# EAGLE design Lab_6 (EAGLE 9.6.2)
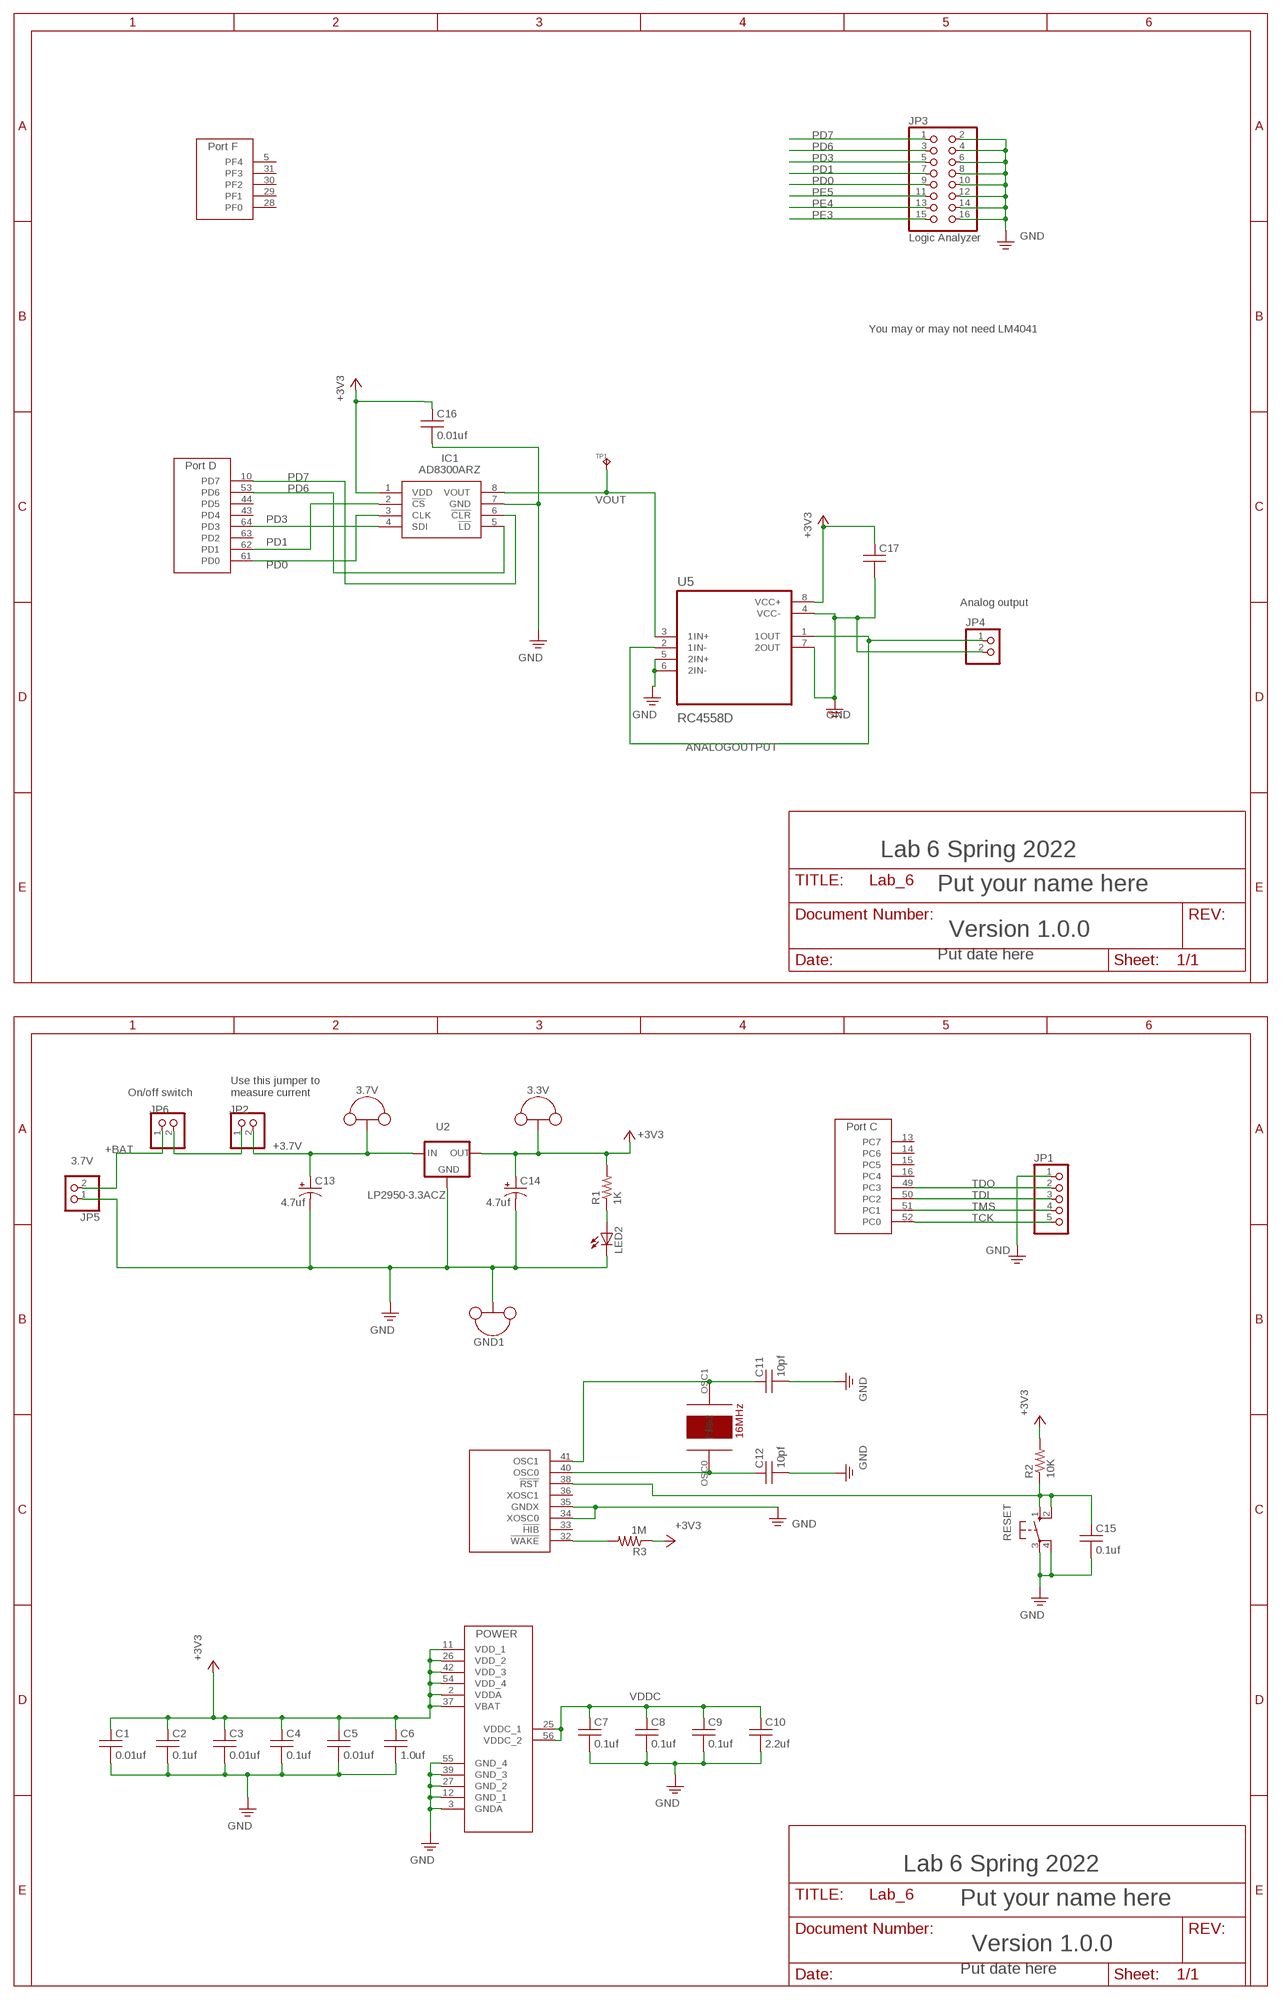
[diagram p0: schematic, sheet 1, part 1 of 2]
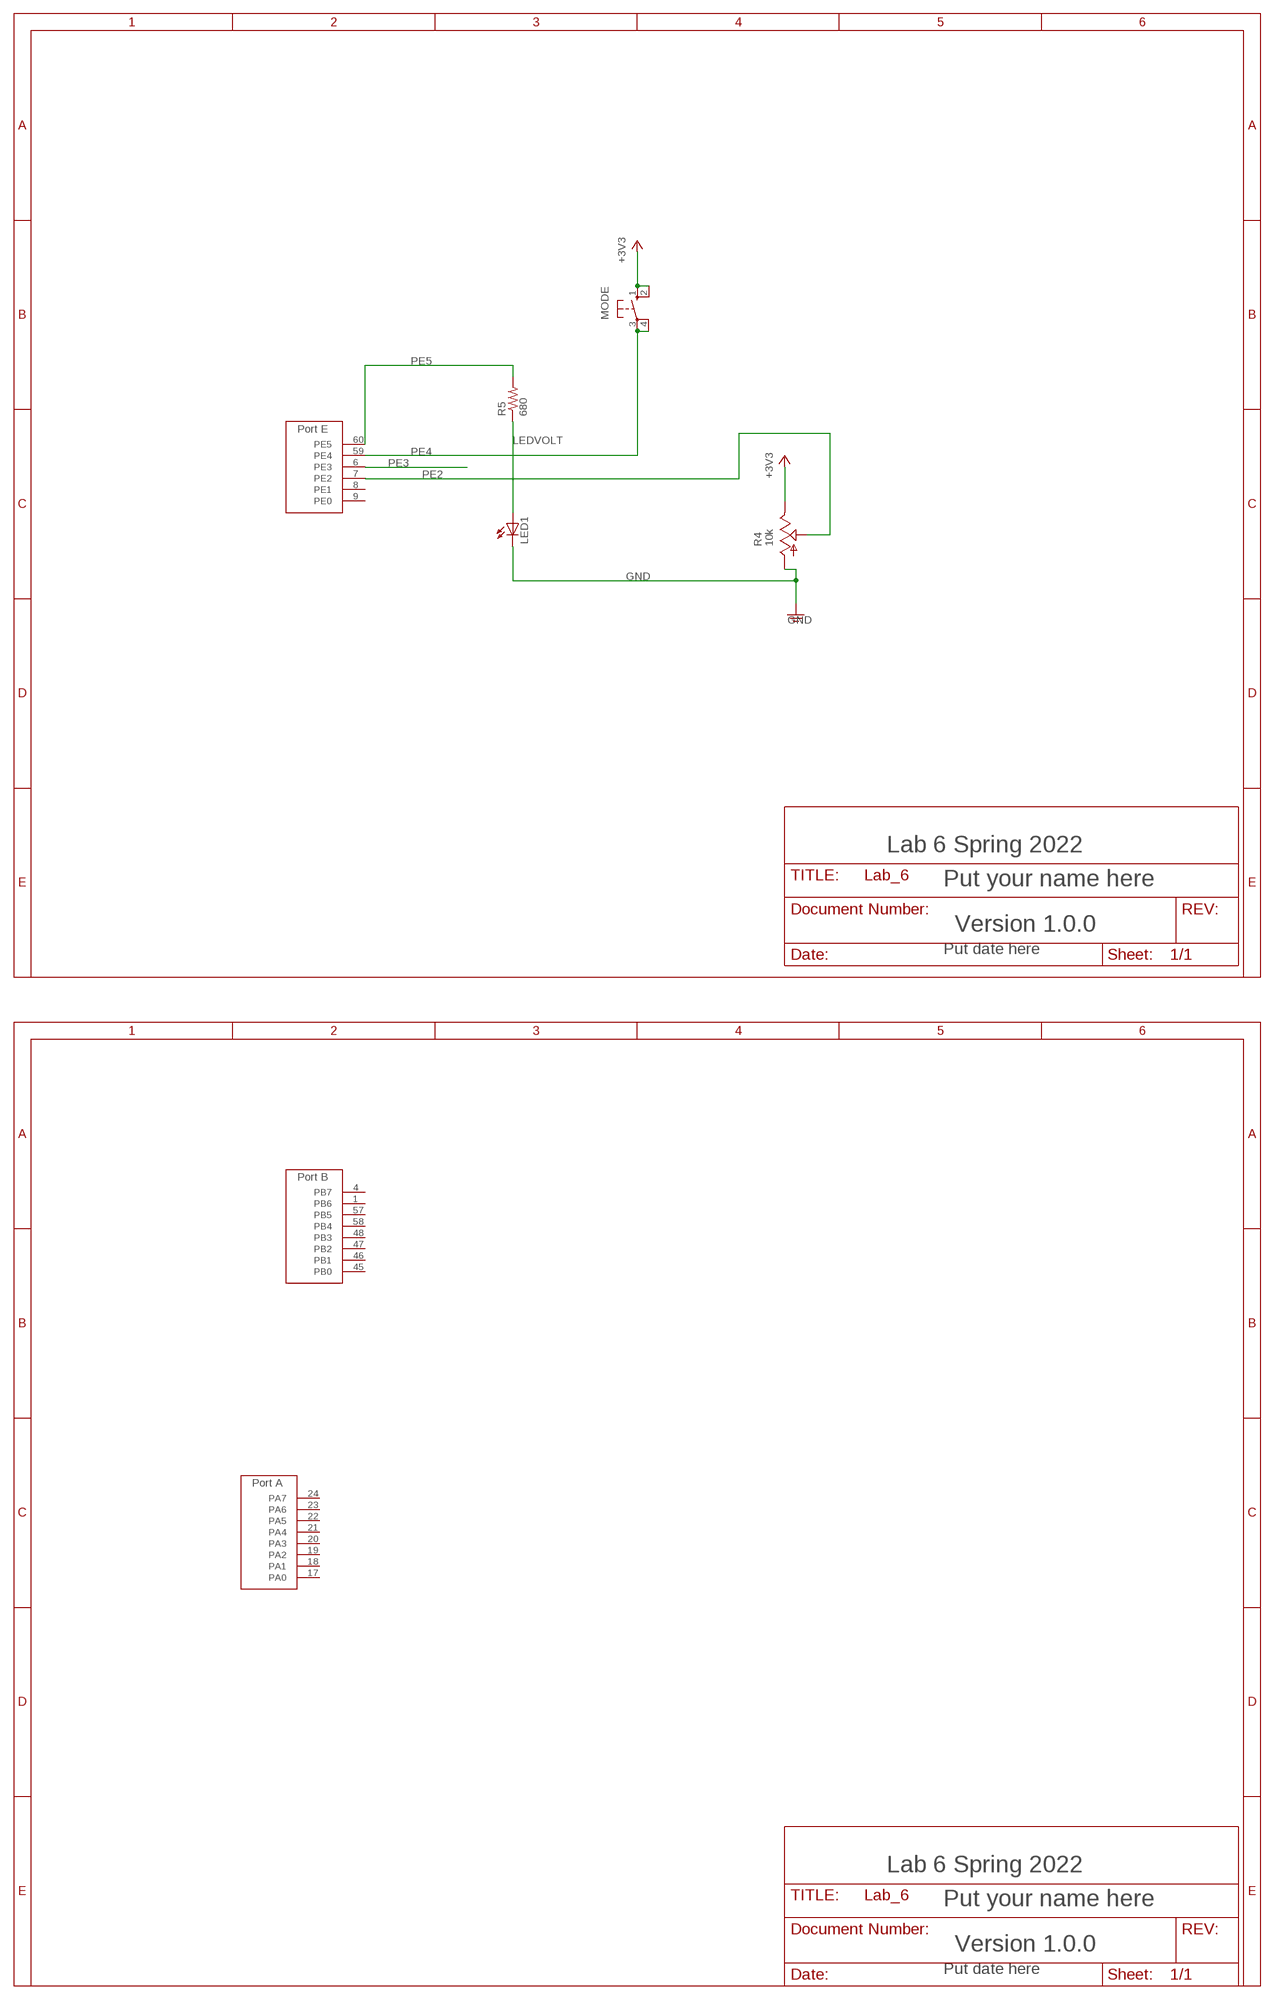
[diagram p1: schematic, sheet 1, part 2 of 2]

## Parts
3.3V  TP_LOOP  [TP_LOOP]
3.7V  TP_LOOP  [TP_LOOP]
C1  0.01uf  CAPACITOR025-024X044  [CAP100MIL]
C2  0.1uf  CAPACITOR025-024X044  [CAP100MIL]
C3  0.01uf  CAPACITOR025-024X044  [CAP100MIL]
C4  0.1uf  CAPACITOR025-024X044  [CAP100MIL]
C5  0.01uf  CAPACITOR025-024X044  [CAP100MIL]
C6  1.0uf  CAPACITOR025-024X044  [CAP100MIL]
C7  0.1uf  CAPACITOR025-024X044  [CAP100MIL]
C8  0.1uf  CAPACITOR025-024X044  [CAP100MIL]
C9  0.1uf  CAPACITOR025-024X044  [CAP100MIL]
C10  2.2uf  CAPACITOR025-024X044  [CAP100MIL]
C11  10pf  CAPACITOR025-024X044  [CAP100MIL]
C12  10pf  CAPACITOR025-024X044  [CAP100MIL]
C13  4.7uf  CAPACITOR_POLARIZEDE5-6  [CAP200MILPOLARIZED]
C14  4.7uf  CAPACITOR_POLARIZEDE5-6  [CAP200MILPOLARIZED]
C15  0.1uf  CAPACITOR025-024X044  [CAP100MIL]
C16  0.01uf  CAPACITOR025-024X044  [CAP100MIL]
C17  0.01uf  CAPACITOR025-024X044  [CAP100MIL]
GND1  TP_LOOP  [TP_LOOP]
IC1  AD8300ARZ  [SOIC127P600X175-8N]
JP1  PINHD-1X5  [1X05]
JP2  PINHD-1X2  [1X02]
JP3  Logic Analyzer  PINHD-2X8  [2X08]
JP4  PINHD-1X2  [1X02]
JP5  PINHD-1X2  [1X02]
JP6  PINHD-1X2  [1X02]
LED1  LED3MM  [LED3MM]
LED2  LED3MM  [LED3MM]
MODE  B3F-1052  [B3F-10XX]
R1  1K  RESISTOR0204/5  [RES200MIL]
R2  10K  RESISTOR0204/5  [RES200MIL]
R3  1M  RESISTOR0204/5  [RES200MIL]
R4  10k  POTENTIOMETER_PTA2043B25U  [PTA2043]
R5  680  RESISTOR0204/5  [RES200MIL]
RESET  B3F-1052  [B3F-10XX]
TP1  TP_KEYSTONE500X  [P1.1MM]
U1  TM4C123GH6PM  [QFP50P1200X1200X160-64N]
U2  LP2950-3.3ACZ  [TO92]
U5  RC4558D  [SOIC127P599X175-8N]
Y1  16MHZ_CRYSTAL  [16MHZ_CRYSTAL]

## Nets
+3.7V: 3.7V.P$1(TP) 3.7V.P$2(TP) C13.+ JP2.2 U2.3(IN)
+3V3: 3.3V.P$1(TP) 3.3V.P$2(TP) C1.1 C2.1 C3.1 C4.1 C5.1 C6.1 C14.+ C16.1 C17.1 IC1.1(VDD) MODE.1(S) MODE.2(S1) R1.2 R2.2 R3.1 R4.1(E) U1.2(VDDA) U1.11(VDD_1) U1.26(VDD_2) U1.37(VBAT) U1.42(VDD_3) U1.54(VDD_4) U2.1(OUT) U5.8(VCC+)
+BAT: JP5.2 JP6.1
ANALOGOUTPUT: JP4.1 U5.1(1OUT) U5.2(1IN-)
GND: C1.2 C2.2 C3.2 C4.2 C5.2 C6.2 C7.2 C8.2 C9.2 C10.2 C11.2 C12.2 C13.- C14.- C15.2 C16.2 C17.2 GND1.P$1(TP) GND1.P$2(TP) IC1.7(GND) JP1.1 JP3.2 JP3.4 JP3.6 JP3.8 JP3.10 JP3.12 JP3.14 JP3.16 JP4.2 JP5.1 LED1.K(C) LED2.K(C) R4.3(A) RESET.3(P) RESET.4(P1) U1.3(GNDA) U1.12(GND_1) U1.27(GND_2) U1.34(XOSC0) U1.35(GNDX) U1.39(GND_3) U1.55(GND_4) U2.2(GND) U5.4(VCC-) U5.5(2IN+) U5.6(2IN-) U5.7(2OUT)
LEDVOLT: LED1.A R5.1
OSC0: C12.1 U1.40(OSC0) Y1.OSC0
OSC1: C11.1 U1.41(OSC1) Y1.OSC1
PD0: IC1.3(CLK) JP3.9 U1.61(PD0)
PD1: IC1.2(!CS) JP3.7 U1.62(PD1)
PD3: IC1.4(SDI) JP3.5 U1.64(PD3)
PD6: IC1.5(!LD) JP3.3 U1.53(PD6)
PD7: IC1.6(!CLR) JP3.1 U1.10(PD7)
PE2: R4.2(S) U1.7(PE2)
PE3: JP3.15 U1.6(PE3)
PE4: JP3.13 MODE.3(P) MODE.4(P1) U1.59(PE4)
PE5: JP3.11 R5.2 U1.60(PE5)
POWERLED: LED2.A R1.1
RESET: C15.1 R2.1 RESET.1(S) RESET.2(S1) U1.38(!RST)
SWITCHEDPOWER: JP2.1 JP6.2
TCK: JP1.5 U1.52(PC0)
TDI: JP1.3 U1.50(PC2)
TDO: JP1.2 U1.49(PC3)
TMS: JP1.4 U1.51(PC1)
VDDC: C7.1 C8.1 C9.1 C10.1 U1.25(VDDC_1) U1.56(VDDC_2)
VOUT: IC1.8(VOUT) TP1.TP U5.3(1IN+)
WAKE: R3.2 U1.32(!WAKE)
Unconnected: U1.1(PB6) U1.4(PB7) U1.5(PF4) U1.8(PE1) U1.9(PE0) U1.13(PC7) U1.14(PC6) U1.15(PC5) U1.16(PC4) U1.17(PA0) U1.18(PA1) U1.19(PA2) U1.20(PA3) U1.21(PA4) U1.22(PA5) U1.23(PA6) U1.24(PA7) U1.28(PF0) U1.29(PF1) U1.30(PF2) U1.31(PF3) U1.33(!HIB) U1.36(XOSC1) U1.43(PD4) U1.44(PD5) U1.45(PB0) U1.46(PB1) U1.47(PB2) U1.48(PB3) U1.57(PB5) U1.58(PB4) U1.63(PD2)

## Notes on the sheet
- You may or may not need LM4041
- Analog output
- Lab 6 Spring 2022
- Lab 6 Spring 2022
- Put your name here
- Put your name here
- Version 1.0.0
- Version 1.0.0
- Put date here
- Put date here
- On/off switch
- Use this jumper to
  measure current
- 3.7V
- Lab 6 Spring 2022 | Lab 6 Spring 2022
- Put your name here | Put your name here
- Version 1.0.0 | Version 1.0.0
- Put date here | Put date here

## Library data of the parts
3.3V 3.7V GND1 = EE445L:TP_LOOP
C1-C12 C15-C17 = EE445L:CAPACITOR: CAPACITOR, American symbol
C13 C14 = EE445L:CAPACITOR_POLARIZED: POLARIZED CAPACITOR, American symbol
IC1 = AD8300ARZ:AD8300ARZ: DAC 1-Ch R-2R 12-Bit 8-Pin SOIC Source: Datasheet <https://datasheet.datasheetarchive.com/originals/distributors/Datasheets-4/DSA-70310.pdf>; DESCRIPTION: DAC 1-Ch R-2R 12-Bit 8-Pin SOIC; HEIGHT: 1.75mm; MANUFACTURER_NAME: Analog Devices; MANUFACTURER_PART_NUMBER: AD8300ARZ
JP1 = EE445L:PINHD-1X5: PIN HEADER
JP2 JP4-JP6 = EE445L:PINHD-1X2: PIN HEADER
JP3 = EE445L:PINHD-2X8: PIN HEADER
LED1 LED2 = EE445L:LED: Avago Technologies LED Green 2mA 5mm diffused, HLMP-4740, Digikey 516-1327-ND Red 1.6V 1mA 5mm diffused, HLMP-D150, Digikey 516-1323-ND Yellow 2mA 5mm diffused, HLMP-4719, Digikey 516-1326-ND Orange 10mA 5mm diffused HLMP-D401, Digikey 516-1330-ND Blue 10mA 5mm diffused
MODE RESET = EE445L:B3F-1052: OMRON SWITCH 1.1mm holes; MPN: B3F-1000; OC_FARNELL: 176432; OC_NEWARK: 36M3542
R1-R3 R5 = EE445L:RESISTOR: RESISTOR, American symbol
R4 = EE445L:POTENTIOMETER_PTA2043: POTENTIOMETER Warning There are many many sizes and shapes of potentiometers. Please verify both the wiring and the physical layout of your pots.
TP1 = EE445L:TP: Test pad Test point, black, Keystone Electronics 5001, Digikey 5001K-ND Test point, orange, Keystone Electronics 5003, Digikey 5003K-ND Test point, yellow, Keystone Electronics 5004, Digikey 5004K-ND Test point, white, Keystone Electronics 5002, Digikey 5002K-ND Test point, red, Keystone Electronics 5000, Digikey 5000K-ND
U1 = EE445L:TM4C123GH6PM
U2 = EE445L:LP2950: LP2950 3.3V regulator, 100 mA TO-92 On Semiconductor LP2950ACZ-3.3G, Mouser 863-LP2950ACZ-3.3G
U5 = RC4558D:RC4558D: Check availability <https://pricing.snapeda.com/parts/RC4558D/Texas%20Instruments/view-part?ref=eda>; AVAILABILITY: In Stock; DESCRIPTION: Dual, 30-V, 3-MHz, low noise (8-nV/√Hz) operational amplifier; MF: Texas Instruments; MP: RC4558D; PACKAGE: SOIC-8 Texas Instruments; PRICE: None; PURCHASE-URL: https://pricing.snapeda.com/search/part/RC4558D/?ref=eda
Y1 = EE445L:16MHZ_CRYSTAL

## Board
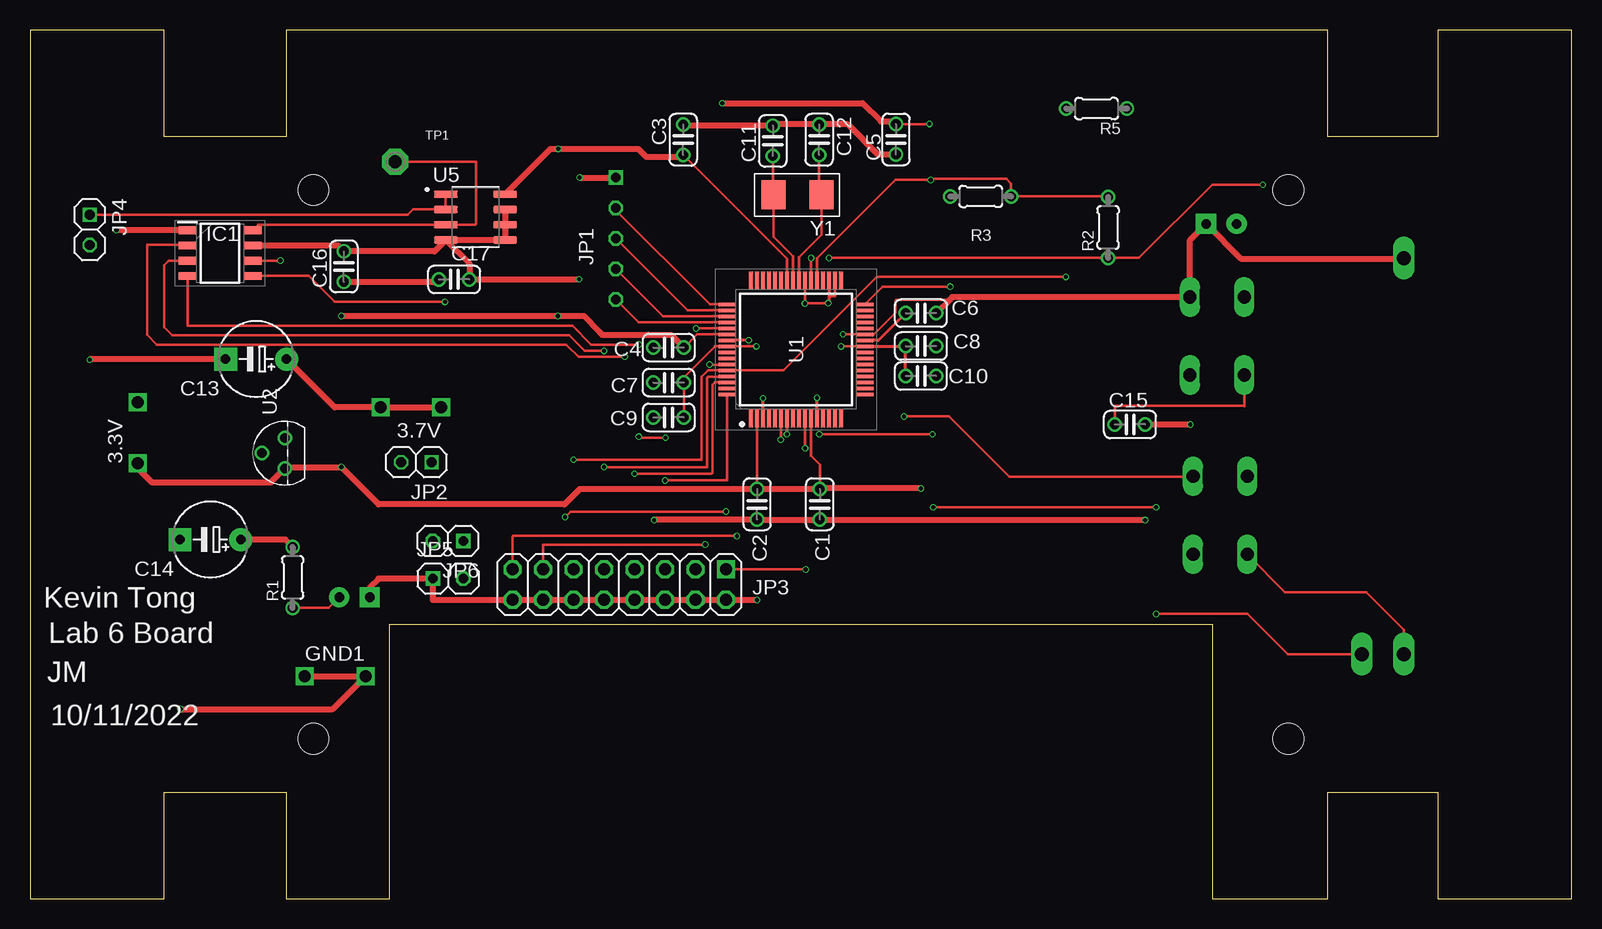
[diagram p2: board, top side]
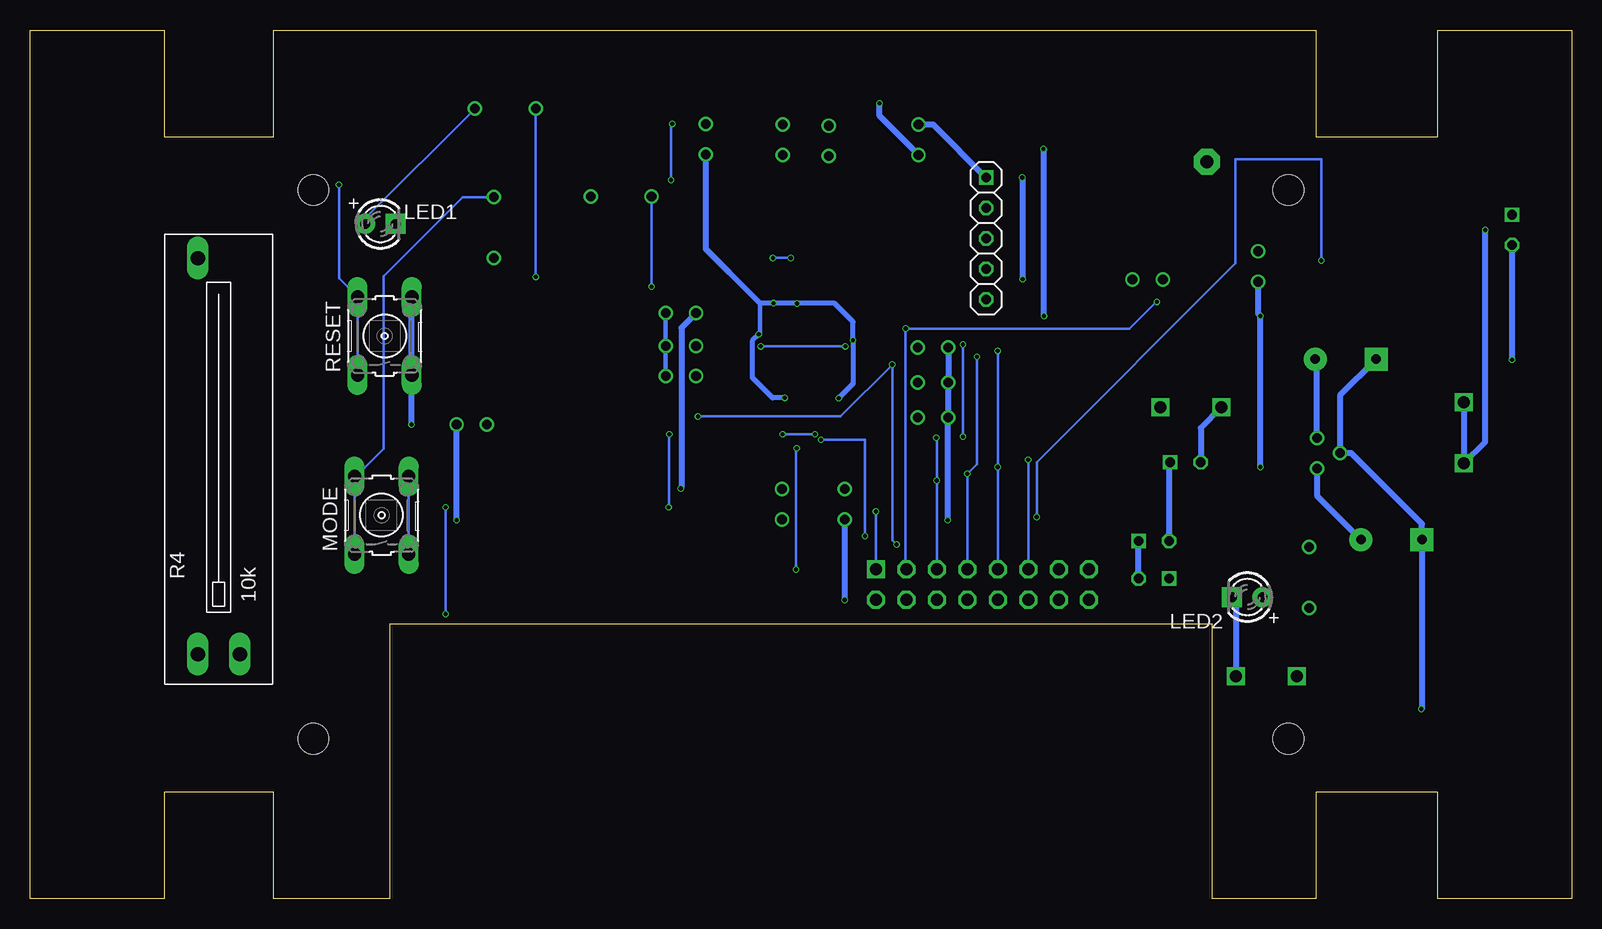
[diagram p3: board, bottom side, seen from below]

Size 128.52 x 72.39 mm. Coordinates in mm from the lower left corner, seen from the top.
Outline: 0,0 11.18,0 11.18,8.89 21.34,8.89 21.34,0 29.97,0 29.97,22.86 98.55,22.86 98.55,0 108.2,0 108.2,8.89 117.35,8.89 117.35,0 128.52,0 128.52,72.39 117.35,72.39 117.35,63.5 108.2,63.5 108.2,72.39 21.34,72.39 21.34,63.5 11.18,63.5 11.18,72.39 0,72.39 0,0
Copper layers (1*16): Top 0.035559375mm / dielectric 1.6mm / Bottom 0.035559375mm
Design rules "jlcpcb2layer": minimum track width 5mil, minimum drill 12mil, track to track 5mil, track to pad 5mil, pad to pad 5mil, via to via 5mil, smd to smd 5mil, copper to edge 8mil, drill to drill 6mil, minimum pad ring 5mil, minimum via ring 3mil, stop-mask expansion 2.5mil, vias tented up to drill 0mil, thermal gap 10mil
Holes 2.54 mm at 23.62,13.34 104.9,13.34 104.9,59.05 23.62,59.05

### Footprints (pad centres in the part's own frame; a part is rotated, then mirrored left to right if it is on the bottom)
TP_LOOP = drill 1 square: P$1 0,0; P$2 5.08,0
CAP100MIL = drill 0.8: 1 -1.27,0; 2 1.27,0
CAP200MILPOLARIZED = drill 0.8 pad 1.905: + -2.54,0 | drill 0.8 pad 1.905 square: - 2.54,0
SOIC127P600X175-8N = smd 1.525 x 0.65: 1 -2.712,1.905; 2 -2.712,0.635; 3 -2.712,-0.635; 4 -2.712,-1.905; 5 2.712,-1.905; 6 2.712,-0.635; 7 2.712,0.635; 8 2.712,1.905
1X05 = drill 0.8 square: 1 -5.08,0 | drill 0.8 octagon: 2 -2.54,0; 3 0,0; 4 2.54,0; 5 5.08,0
1X02 = drill 0.8 square: 1 -1.27,0 | drill 0.8 octagon: 2 1.27,0
2X08 = drill 1 square: 1 -8.89,-1.27 | drill 1 octagon: 2 -8.89,1.27; 3 -6.35,-1.27; 4 -6.35,1.27; 5 -3.81,-1.27; 6 -3.81,1.27; 7 -1.27,-1.27; 8 -1.27,1.27; 9 1.27,-1.27; 10 1.27,1.27; 11 3.81,-1.27; 12 3.81,1.27; 13 6.35,-1.27; 14 6.35,1.27; 15 8.89,-1.27; 16 8.89,1.27
LED3MM = drill 0.8 pad 1.676: A -1.27,0 | drill 0.8 pad 1.676 square: K 1.27,0
B3F-10XX = drill 1.1 long: 1 -3.251,2.261; 2 3.251,2.261; 3 -3.251,-2.261; 4 3.251,-2.261
RES200MIL = drill 0.8: 1 -2.54,0; 2 2.54,0
PTA2043 = drill 1.194 long: 1 -13,1.75; 2 -13,-1.75; 3 20,1.75
P1.1MM = drill 1.1 pad 2.159 octagon: TP 0,0
QFP50P1200X1200X160-64N = smd 1.475 x 0.3: 1 -5.738,3.75; 2 -5.738,3.25; 3 -5.738,2.75; 4 -5.738,2.25; 5 -5.738,1.75; 6 -5.738,1.25; 7 -5.738,0.75; 8 -5.738,0.25; 9 -5.738,-0.25; 10 -5.738,-0.75; 11 -5.738,-1.25; 12 -5.738,-1.75; 13 -5.738,-2.25; 14 -5.738,-2.75; 15 -5.738,-3.25; 16 -5.738,-3.75; 33 5.738,-3.75; 34 5.738,-3.25; 35 5.738,-2.75; 36 5.738,-2.25; 37 5.738,-1.75; 38 5.738,-1.25; 39 5.738,-0.75; 40 5.738,-0.25; 41 5.738,0.25; 42 5.738,0.75; 43 5.738,1.25; 44 5.738,1.75; 45 5.738,2.25; 46 5.738,2.75; 47 5.738,3.25; 48 5.738,3.75 | smd 0.3 x 1.475: 17 -3.75,-5.738; 18 -3.25,-5.738; 19 -2.75,-5.738; 20 -2.25,-5.738; 21 -1.75,-5.738; 22 -1.25,-5.738; 23 -0.75,-5.738; 24 -0.25,-5.738; 25 0.25,-5.738; 26 0.75,-5.738; 27 1.25,-5.738; 28 1.75,-5.738; 29 2.25,-5.738; 30 2.75,-5.738; 31 3.25,-5.738; 32 3.75,-5.738; 49 3.75,5.738; 50 3.25,5.738; 51 2.75,5.738; 52 2.25,5.738; 53 1.75,5.738; 54 1.25,5.738; 55 0.75,5.738; 56 0.25,5.738; 57 -0.25,5.738; 58 -0.75,5.738; 59 -1.25,5.738; 60 -1.75,5.738; 61 -2.25,5.738; 62 -2.75,5.738; 63 -3.25,5.738; 64 -3.75,5.738
TO92 = drill 0.8: 1 -1.27,0; 2 0,1.905; 3 1.27,0
SOIC127P599X175-8N = smd 1.97 x 0.6: 1 -2.47,1.905; 2 -2.47,0.635; 3 -2.47,-0.635; 4 -2.47,-1.905; 5 2.47,-1.905; 6 2.47,-0.635; 7 2.47,0.635; 8 2.47,1.905
16MHZ_CRYSTAL = smd 2 x 2.4: OSC0 1,1.27; OSC1 5,1.27

### Placement (x,y rotation side)
3.3V  8.99,36.27 90 top
3.7V  34.29,40.94 180 top
C1  65.84,32.87 270 top
C2  60.6,32.87 270 top
C3  54.46,63.25 90 top
C4  53.24,45.92 180 top
C5  72.19,63.27 270 top
C6  74.27,48.79 0 top
C7  53.24,43 180 top
C8  74.27,46.05 0 top
C9  53.24,40.11 180 top
C10  74.27,43.56 0 top
C11  61.93,63.14 90 top
C12  65.79,63.25 90 top
C13  18.85,44.96 180 top
C14  15.04,29.92 180 top
C15  91.69,39.52 0 top
C16  26.16,52.68 90 top
C17  35.36,51.61 0 top
GND1  22.91,18.54 0 top
IC1  15.85,53.8 0 top
JP1  48.82,55.02 270 bottom
JP2  32.21,36.37 180 top
JP3  49.12,26.16 180 top
JP4  4.98,55.73 270 top
JP5  34.85,26.67 0 top
JP6  34.85,29.82 180 top
LED1  99.31,56.24 0 bottom
LED2  27.05,25.12 180 bottom
MODE  99.21,31.95 90 bottom
R1  21.89,26.77 90 top
R2  89.87,55.93 90 top
R3  79.25,58.52 180 top
R4  112.78,33.38 90 bottom
R5  88.9,65.84 180 top
RESET  98.96,46.89 90 bottom
TP1  30.43,61.42 0 top
U1  63.86,45.77 90 top
U2  21.23,37.13 90 top
U5  37.13,56.79 0 top
Y1  66.98,59.92 180 top

### Tracks (layer width: path | path; a pad name or v marks a point on that pad's centre or on a via)
+3.7V
  Top 0.508: 3.7V.P$1 3.7V.P$2 25.4,40.95 C13.+
  Bottom 0.508: 3.7V.P$2 30.94,39.22 JP2.2 | U2.3 21.23,44.81 C13.+
+3V3  (via drill 0.35)
  Top 0.203: U1.2 C2.1 | U1.11 65.11,36.9 65.84,36.17 65.84,34.34 C1.1 | C3.1 54.53,61.9 63.11,53.33 U1.42 | U1.37 65.61,53.36 72.14,59.89 v75.08,59.89 75.18,59.99 81.38,59.99 81.79,59.59 R3.1 89.81,58.52 R2.2 | v74.98,64.57 74.95,64.54 C5.1 | MODE.1 104.62,25.55 111.4,25.55 114.53,22.43 R4.1 | U1.54 55.61,47.02 C4.1
  Top 0.254: C6.1 70.73,46.52 U1.26
  Top 0.508: 3.3V.P$1 8.99,35.87 10.16,34.7 20.07,34.7 U2.1 21.34,35.97 v25.96,35.97 29.06,32.87 44.55,32.87 45.82,34.14 C2.1 | R1.2 21.29,29.92 C14.+ | v25.96,48.56 v43.99,48.56 46.18,48.56 47.5,47.24 47.5,47.19 47.7,46.99 53.44,46.99 C4.1 | C1.1 C2.1 | v74.27,34.19 65.99,34.19 65.84,34.34 | 54.53,61.9 54.46,61.82 51.36,61.82 50.7,62.48 v44.04,62.48 43.39,62.48 U5.8 | v57.71,66.29 69.39,66.29 70.92,64.77 72.05,64.77 C5.1 | C16.1 33.88,51.41 C17.1 | v7.21,55.73 13.11,55.73 IC1.1
  Bottom 0.203: v75.08,59.89 75.08,64.47 v74.98,64.57 | R2.2 92.46,58.47 99.06,51.87 99.06,37.49 101.35,35.2 MODE.2 MODE.1
  Bottom 0.508: 3.3V.P$2 3.3V.P$1 7.21,38.05 v7.21,55.73 | U2.1 21.23,33.58 C14.+ | v25.96,35.97 v25.96,48.56 26.16,48.77 C16.1 | C6.1 74.22,47.57 74.22,34.24 v74.27,34.19 | v43.99,48.56 43.99,62.43 v44.04,62.48 | C3.1 57.71,65.23 v57.71,66.29
+BAT
  Bottom 0.508: JP5.2 JP6.1
ANALOGOUTPUT
  Top 0.203: JP4.1 31.5,57 31.95,57.45 34.64,57.45 U5.2 U5.1
GND  (via drill 0.35)
  Top 0.203: v67.77,47.04 67.79,47.02 U1.27 70.34,47.02 72.14,48.82 72.14,49.84 72.22,49.92 76.67,49.92 | v59.91,46.54 59.89,46.52 | v65.61,41.73 | U1.34 67.11,50.19 66.61,50.19 | v66.55,49.63 64.62,49.63 v64.59,49.61 64.61,49.62 U1.39
  Top 0.254: U1.3 v61.11,41.71 | 59.89,46.52 U1.55 | U1.12 v65.61,41.73 | U1.35 66.61,50.19 66.61,49.69 v66.55,49.63
  Top 0.508: v60.6,24.89 JP3.2 JP3.4 JP3.6 JP3.8 JP3.10 JP3.12 JP3.14 JP3.16 33.58,24.89 JP5.1 29.06,26.67 28.32,25.93 LED2.K | GND1.P$1 GND1.P$2 25.25,15.8 v12.55,15.8 | v52.02,31.55 52.07,31.6 C2.2 C1.2 92.91,31.6 v92.96,31.55 | C15.2 v96.72,39.52 | C6.2 76.67,49.92 76.89,50.14 RESET.4 96.7,54.89 LED1.K 100.94,53.34 114.49,53.34 R4.3 | C5.2 70.69,62 68.17,64.52 C12.2 62.03,64.52 C11.2 54.56,64.41 C3.2 | v45.77,51.61 C17.2 36.63,52.93 U5.4 | v45.82,60.1 JP1.1 | U5.4 33.73,53.95 C16.2 25.68,54.43 IC1.7 | C13.- 5.03,44.96 v4.98,44.91 | U5.7 U5.6 U5.5 U5.4
  Bottom 0.203: v61.11,41.71 61.11,41.73
  Bottom 0.381: C10.2 75.54,46.4 75.46,46.48 C8.2 C6.2 | v67.77,47.04 67.67,47.14 67.67,49.61
  Bottom 0.406: 61.11,41.73 59.91,42.93 v59.91,46.54 59.91,48.08 61.44,49.61 v64.59,49.61 67.67,49.61 70.23,52.17 | v67.77,47.04 68.33,46.48 68.33,43.43 66.62,41.73 v65.61,41.73
  Bottom 0.508: v60.6,24.89 C2.2 | LED2.K 27.99,24.79 GND1.P$2 | v52.02,31.55 52.02,40.06 C9.2 C7.2 C4.2 | v92.96,31.55 C15.2 | v96.72,39.52 96.72,43.61 RESET.3 RESET.4 | 70.23,52.17 72.19,54.13 C5.2 | C3.2 53.24,64.52 JP1.1 | v45.77,51.61 45.77,60.05 v45.82,60.1 | v4.98,44.91 JP4.2 | C13.- 19.33,41.94 U2.2 18.39,37.13 12.5,31.24 C14.- 12.5,15.85 v12.55,15.8
LEDVOLT
  Bottom 0.203: R5.1 100.58,56.69 LED1.A
OSC0
  Top 0.203: U1.40 64.11,53.44 65.99,55.32 Y1.OSC0 65.79,58.84 C12.1
OSC1
  Top 0.203: U1.41 63.61,53.54 61.98,55.17 Y1.OSC1 61.92,58.7 C11.1
PD0  (via drill 0.35)
  Top 0.203: U1.61 58.08,43.48 56.54,43.48 56.44,43.38 56.44,35.97 v47.85,35.97 | IC1.3 11.56,53.16 11.18,52.78 11.18,47.6 11.84,46.94 44.96,46.94 46.24,45.65 v47.85,45.65
  Bottom 0.203: JP3.9 v47.85,35.97 v47.85,45.65
PD1  (via drill 0.35)
  Top 0.203: U1.62 57.11,43.02 57.1,43.03 56.9,42.82 56.9,35.51 56.79,35.41 v50.39,35.41 | v49.58,45.16 45.72,45.16 44.7,46.18 10.57,46.18 9.75,46.99 9.75,54.51 13.06,54.51 IC1.2
  Bottom 0.203: JP3.7 v50.39,35.41 49.58,36.22 v49.58,45.16
PD3  (via drill 0.35)
  Top 0.203: U1.64 58.12,34.85 v52.93,34.85 | v52.98,38.41 50.85,38.41 v50.75,38.51 | v50.75,46.18 46.79,46.18 45.21,47.75 13.16,47.75 13.14,47.77 IC1.4
  Bottom 0.203: JP3.5 v52.93,34.85 52.93,38.35 v52.98,38.41 | v50.75,38.51 v50.75,46.18
PD6  (via drill 0.35)
  Top 0.203: U1.53 55.53,47.52 v55.52,47.51 | v34.59,49.73 25.4,49.73 23.22,51.92 18.59,51.92 IC1.5
  Bottom 0.203: JP3.3 55.52,27.48 v55.52,47.51 36.87,47.51 34.65,49.73 v34.59,49.73
PD7  (via drill 0.35)
  Top 0.203: JP3.1 v64.67,27.43 | v64.61,37.54 U1.10 | v58.01,32.26 45.06,32.26 v44.6,31.8 | v20.88,53.19 20.85,53.16 IC1.6
  Bottom 0.203: v64.67,27.43 64.67,37.49 v64.61,37.54 | JP3.1 v58.01,32.26 | v44.6,31.8 44.6,36.37 28.04,52.93 28.04,61.62 20.88,61.62 v20.88,53.19
PE2  (via drill 0.35)
  Top 0.203: U1.7 63.11,38.72 v63.09,38.71 | v65.79,38.71 v75.23,38.71 | v75.29,32.61 v93.88,32.61 | v93.88,23.72 101.5,23.72 104.85,20.38 R4.2
  Bottom 0.203: v63.09,38.71 v65.79,38.71 | v75.23,38.71 75.23,32.66 v75.29,32.61 | v93.88,32.61 v93.88,23.72
PE3  (via drill 0.35)
  Top 0.203: JP3.15 40.23,30.18 40.28,30.23 v58.93,30.23 | v62.59,38.25 62.59,40.01 U1.6
  Bottom 0.203: v58.93,30.23 58.93,38.25 v62.59,38.25
PE4  (via drill 0.35)
  Top 0.203: JP3.13 42.77,29.52 v56.29,29.52 | v56.64,44.51 U1.59 | v72.85,40.18 76.61,40.18 81.64,35.15 96.9,35.15 MODE.4
  Bottom 0.203: v56.29,29.52 56.64,29.87 v56.64,44.51 60.97,40.18 v72.85,40.18 | MODE.3 MODE.4
PE5  (via drill 0.35)
  Top 0.203: v45.31,36.58 55.98,36.58 55.98,43.48 56.52,44.02 U1.60 62.82,44.02 70.61,51.82 v86.36,51.82
  Bottom 0.203: v45.31,36.58 JP3.11 | v86.36,51.82 R5.2
POWERLED
  Top 0.203: R1.1 24.89,24.23 LED2.A
RESET  (via drill 0.35)
  Top 0.203: C15.1 90.42,41.05 90.47,41.1 101.19,41.1 101.24,41.05 101.24,43.61 RESET.1 | v102.77,59.49 98.55,59.49 92.46,53.39 R2.1 v66.6,53.39 | U1.38 v65.11,53.38 v65.11,53.39
  Bottom 0.203: RESET.1 RESET.2 102.77,51.69 v102.77,59.49 | v65.11,53.39 v66.6,53.39
SWITCHEDPOWER
  Bottom 0.508: JP2.1 33.58,36.27 JP6.2
TCK
  Top 0.203: U1.52 50.73,48.02 JP1.5
TDI
  Top 0.203: U1.50 54.81,49.02 JP1.3
TDO
  Top 0.203: U1.49 56.7,49.52 48.66,57.56 JP1.2
TMS
  Top 0.203: U1.51 52.77,48.52 JP1.4
VDDC  (via drill 0.35)
  Top 0.203: 72.99,46.02 C8.1 | C9.1 C7.1 54.51,43.43 57.1,46.02 U1.56 v60.55,46.02 | U1.25 v67.62,46.02 v67.61,46.02
  Top 0.254: U1.25 72.99,46.02 | C10.1 C8.1
  Bottom 0.203: v60.55,46.02 v67.61,46.02
VOUT
  Top 0.203: IC1.8 19.02,56.16 U5.3 37.11,56.16 37.19,56.24 37.19,61.42 TP1.TP
WAKE  (via drill 0.35)
  Top 0.203: U1.32 71.08,51 v76.71,51
  Bottom 0.203: v76.71,51 R3.2

### Text on the board
tPlace: Kevin Tong | Lab 6 Board | JM | 10/11/2022